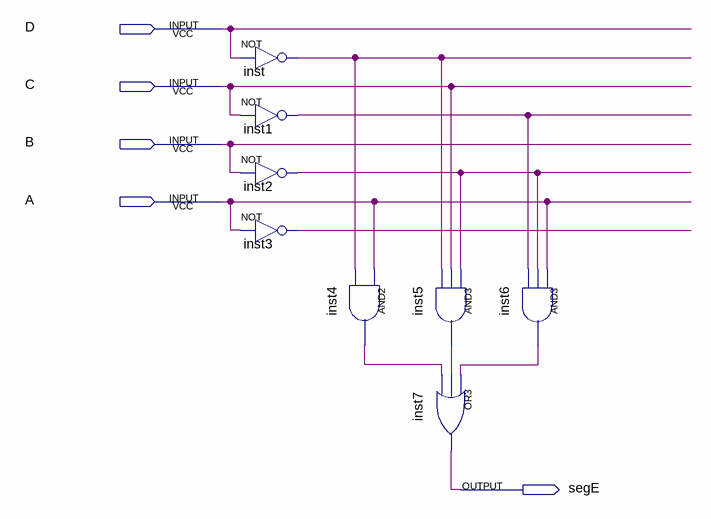
[diagram p0: schematic sheet]
// Quartus schematic segE.bdf as structural Verilog: 8 symbols, 5 pins
module segE (
  input  D,
  input  C,
  input  B,
  input  A,
  output segE
);

  wire inst1_out, inst2_out, inst3_out, inst4_out, inst5_out, inst6_out, inst_out;

  not inst (inst_out, D);
  not inst1 (inst1_out, C);
  not inst2 (inst2_out, B);
  not inst3 (inst3_out, A);
  and inst4 (inst4_out, A, inst_out);
  and inst5 (inst5_out, inst2_out, C, inst_out);
  or inst7 (segE, inst6_out, inst5_out, inst4_out);
  and inst6 (inst6_out, A, inst2_out, inst1_out);
endmodule
